# Altium schematic sheet BLOCK_DIAGRAM.SchDoc
size A3; SheetNumber: 3; SheetTotal: 15
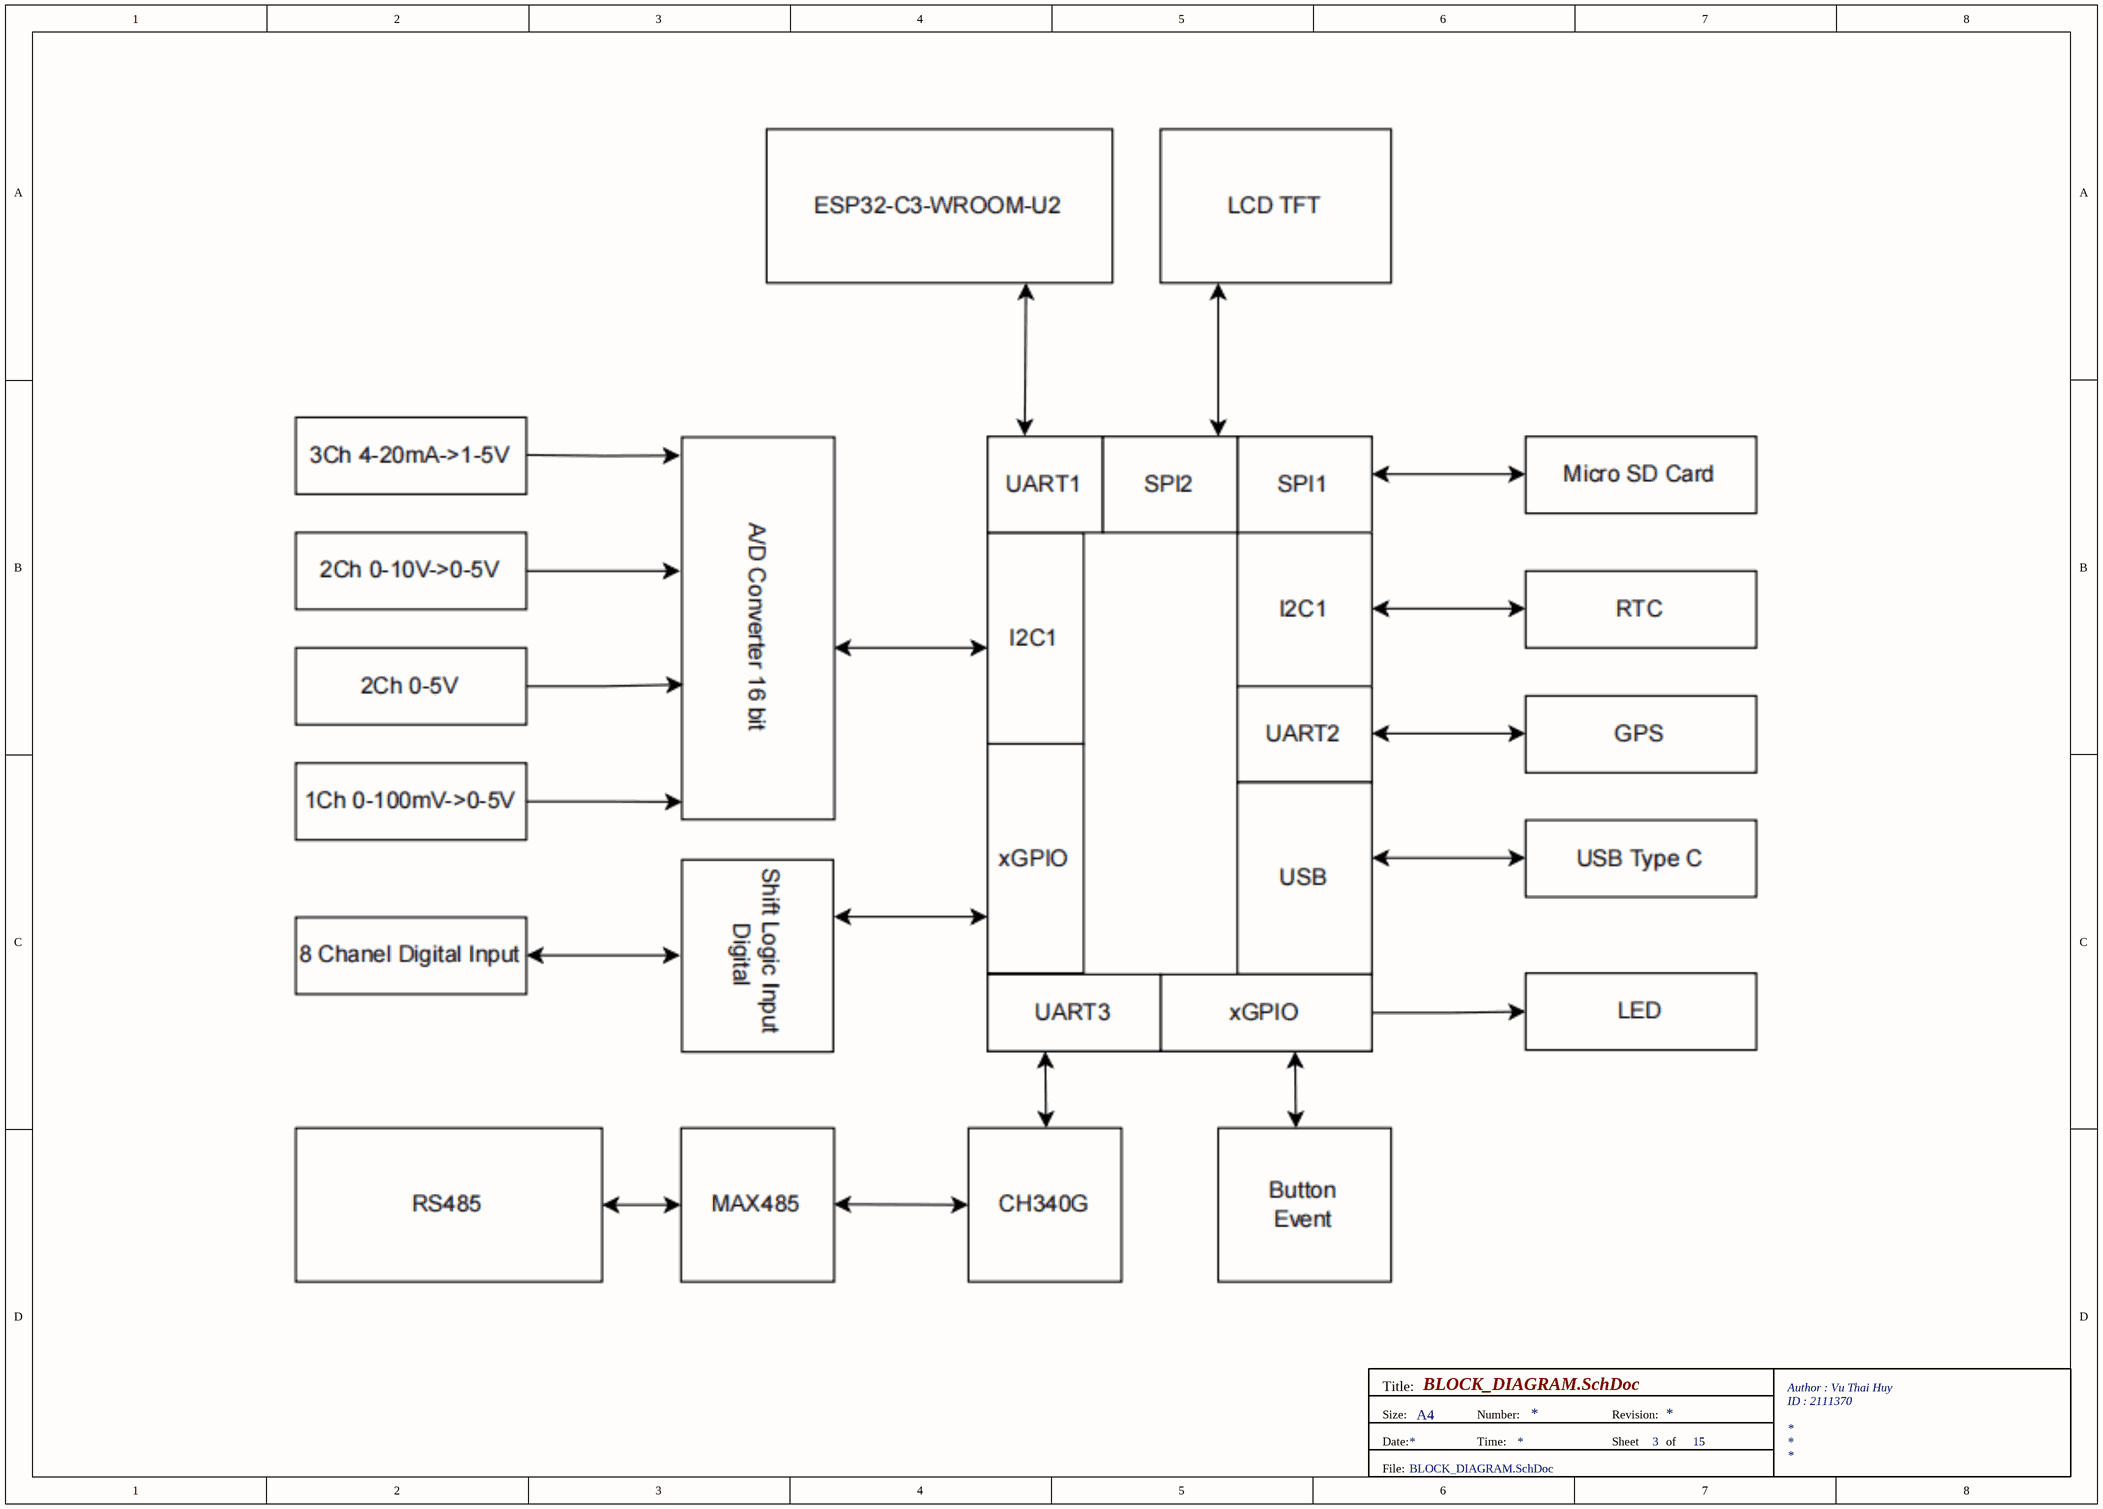
[diagram p0: BLOCK_DIAGRAM.SchDoc]

## Notes on the sheet
- Title:
- Author : Vu Thai Huy
- Size:
- Date:
- A4
- Number:
- Time:
- Revision:
- Sheet
- of
- ID : 2111370
- File: